# EAGLE design Adafruit I2C Quad Rotary Encoder Breakout (EAGLE 9.6.2)
COMPANY: ADAFRUIT INDUSTRIES; DRAWN: KTOWN; REV: A
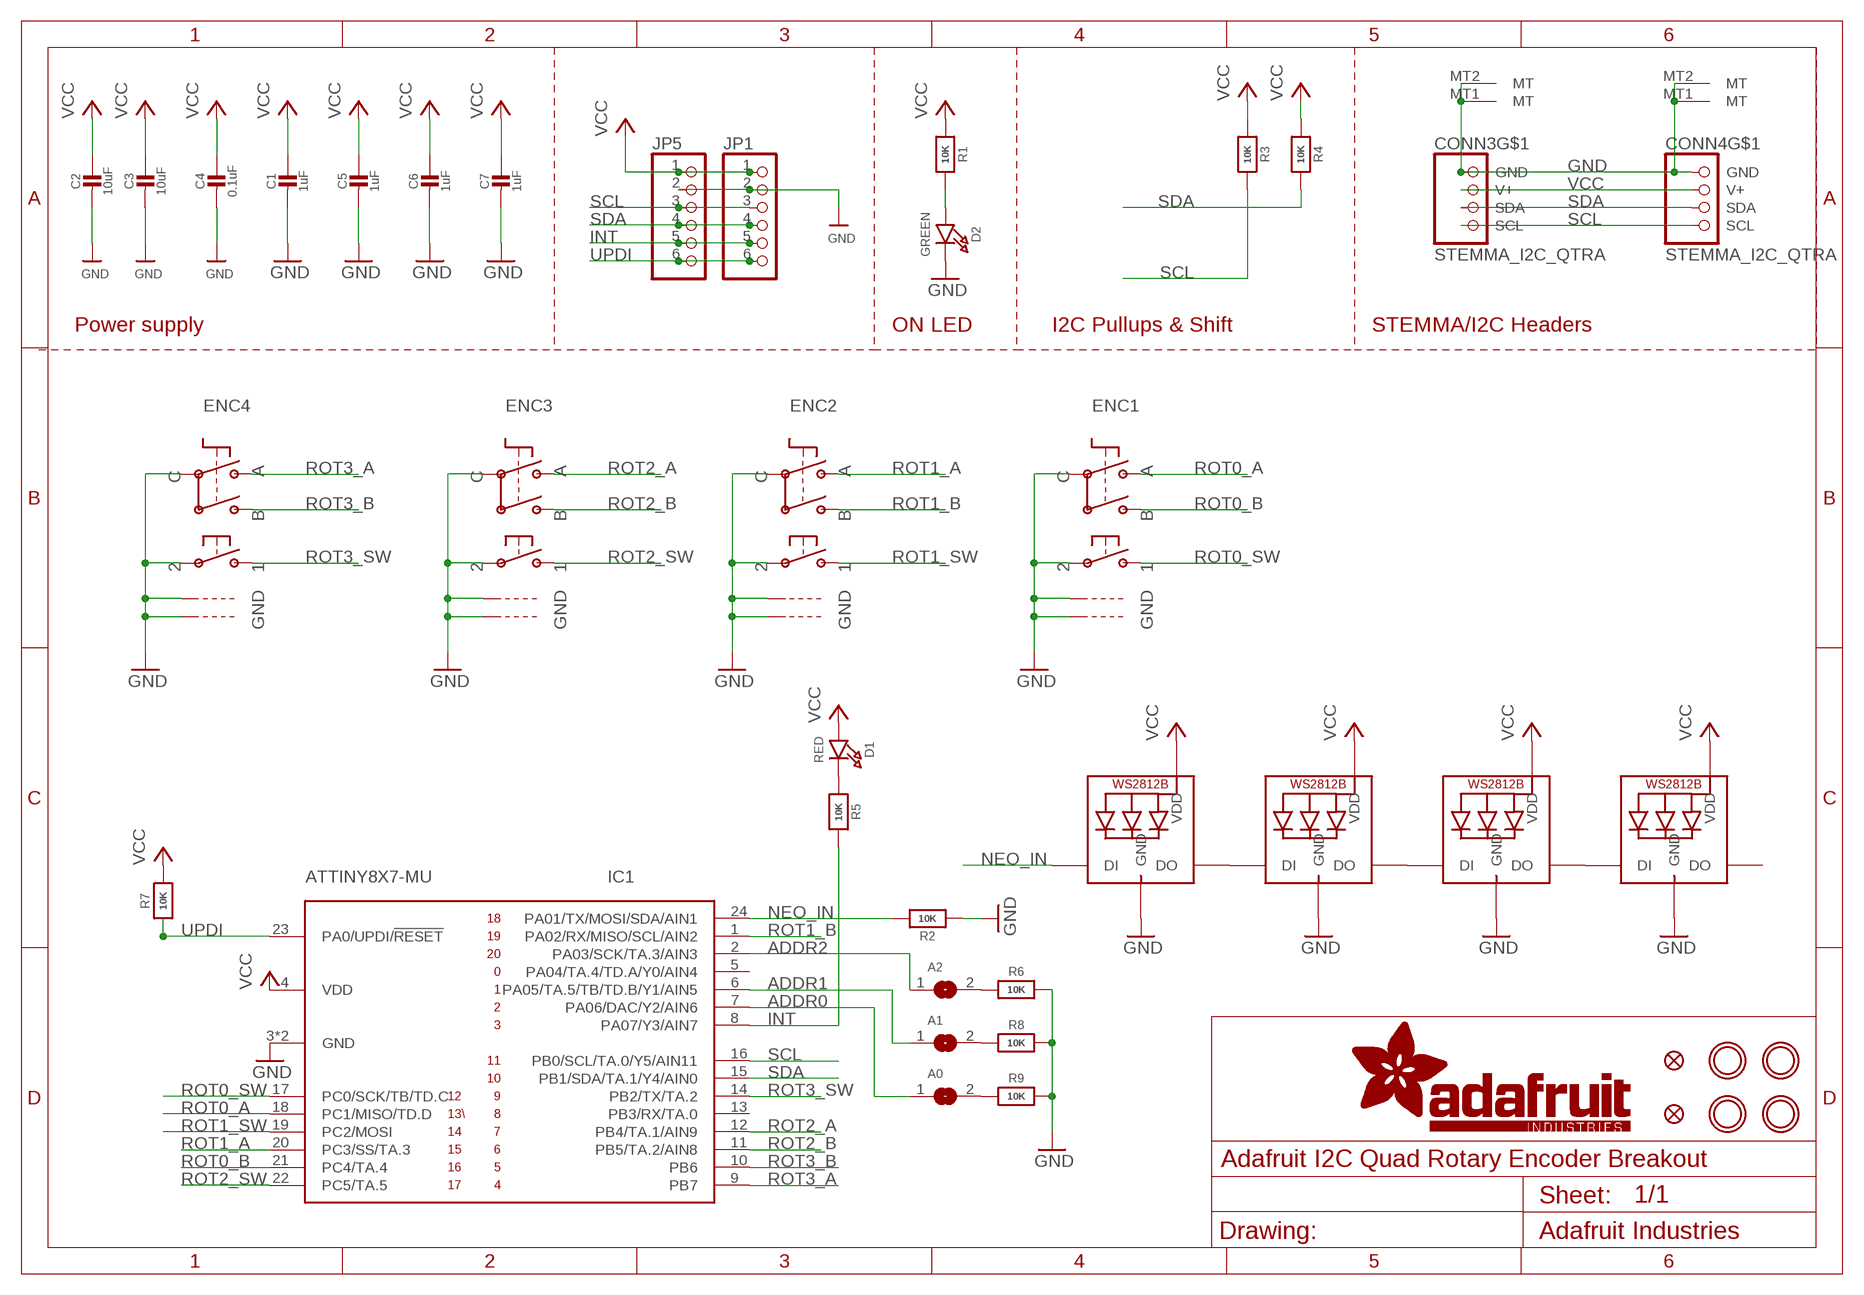
[diagram p0: schematic, sheet 1]

## Parts
A0  SOLDERJUMPERCLOSED  [SOLDERJUMPER_CLOSEDWIRE]
A1  SOLDERJUMPERCLOSED  [SOLDERJUMPER_CLOSEDWIRE]
A2  SOLDERJUMPERCLOSED  [SOLDERJUMPER_CLOSEDWIRE]
C1  1uF  CAP_CERAMIC0603_NO  [0603-NO]
C2  10uF  CAP_CERAMIC0805-NOOUTLINE  [0805-NO]
C3  10uF  CAP_CERAMIC0805-NOOUTLINE  [0805-NO]
C4  0.1uF  CAP_CERAMIC0603_NO  [0603-NO]
C5  1uF  CAP_CERAMIC0603_NO  [0603-NO]
C6  1uF  CAP_CERAMIC0603_NO  [0603-NO]
C7  1uF  CAP_CERAMIC0603_NO  [0603-NO]
CONN3  STEMMA_I2C_QTRA  [JST_SH4_RA]
CONN4  STEMMA_I2C_QTRA  [JST_SH4_RA]
D1  RED  LED0603_NOOUTLINE  [CHIPLED_0603_NOOUTLINE]
D2  GREEN  LED0603_NOOUTLINE  [CHIPLED_0603_NOOUTLINE]
ENC1  ENCODER_PLUS_SWITCH_BOURNS_PEC11  [PEC11+SWITCH]
ENC2  ENCODER_PLUS_SWITCH_BOURNS_PEC11  [PEC11+SWITCH]
ENC3  ENCODER_PLUS_SWITCH_BOURNS_PEC11  [PEC11+SWITCH]
ENC4  ENCODER_PLUS_SWITCH_BOURNS_PEC11  [PEC11+SWITCH]
FID1  FIDUCIAL_1MM  [FIDUCIAL_1MM]
FID2  FIDUCIAL_1MM  [FIDUCIAL_1MM]
IC1  ATTINY8X7-MU  [QFN24_4MM]
JP1  HEADER-1X670MIL  [1X06_ROUND_70]
JP5  HEADER-1X670MIL  [1X06_ROUND_70]
LED1  WS2812B_SK6812E  [NEO3535_REVERSE]
LED2  WS2812B_SK6812E  [NEO3535_REVERSE]
LED3  WS2812B_SK6812E  [NEO3535_REVERSE]
LED4  WS2812B_SK6812E  [NEO3535_REVERSE]
R1  10K  RESISTOR_0603_NOOUT  [0603-NO]
R2  10K  RESISTOR_0603_NOOUT  [0603-NO]
R3  10K  RESISTOR_0603_NOOUT  [0603-NO]
R4  10K  RESISTOR_0603_NOOUT  [0603-NO]
R5  10K  RESISTOR_0603_NOOUT  [0603-NO]
R6  10K  RESISTOR_0603_NOOUT  [0603-NO]
R7  10K  RESISTOR_0603_NOOUT  [0603-NO]
R8  10K  RESISTOR_0603_NOOUT  [0603-NO]
R9  10K  RESISTOR_0603_NOOUT  [0603-NO]
U$3  MOUNTINGHOLE2.5  [MOUNTINGHOLE_2.5_PLATED]
U$17  MOUNTINGHOLE2.5  [MOUNTINGHOLE_2.5_PLATED]
U$19  MOUNTINGHOLE2.5  [MOUNTINGHOLE_2.5_PLATED]
U$21  MOUNTINGHOLE2.5  [MOUNTINGHOLE_2.5_PLATED]

## Nets
ADDR0: A0.1 IC1.7(PA06/DAC/Y2/AIN6)
ADDR1: A1.1 IC1.6(PA05/TA.5/TB/TD.B/Y1/AIN5)
ADDR2: A2.1 IC1.2(PA03/SCK/TA.3/AIN3)
GND: C1.2 C2.2 C3.2 C4.2 C5.2 C6.2 C7.2 CONN3.1(GND) CONN3.MT1(MT) CONN3.MT2(MT) CONN4.1(GND) CONN4.MT1(MT) CONN4.MT2(MT) D2.C ENC1.P$2 ENC1.P$C ENC1.P$GND1 ENC1.P$GND2 ENC2.P$2 ENC2.P$C ENC2.P$GND1 ENC2.P$GND2 ENC3.P$2 ENC3.P$C ENC3.P$GND1 ENC3.P$GND2 ENC4.P$2 ENC4.P$C ENC4.P$GND1 ENC4.P$GND2 IC1.3(GND) IC1.THERM(GND) JP1.2 JP5.2 LED1.3-GND(GND) LED2.3-GND(GND) LED3.3-GND(GND) LED4.3-GND(GND) R2.1 R6.2 R8.2 R9.2
INT: IC1.8(PA07/Y3/AIN7) JP1.5 JP5.5 R5.2
N$1: D2.A R1.2
N$2: LED1.2-DOUT(DO) LED2.4-DIN(DI)
N$3: LED2.2-DOUT(DO) LED3.4-DIN(DI)
N$4: LED3.2-DOUT(DO) LED4.4-DIN(DI)
N$5: D1.C R5.1
N$6: A2.2 R6.1
N$7: A1.2 R8.1
N$8: A0.2 R9.1
NEO_IN: IC1.24(PA01/TX/MOSI/SDA/AIN1) LED1.4-DIN(DI) R2.2
ROT0_A: ENC1.P$A IC1.18(PC1/MISO/TD.D)
ROT0_B: ENC1.P$B IC1.21(PC4/TA.4)
ROT0_SW: ENC1.P$1 IC1.17(PC0/SCK/TB/TD.C)
ROT1_A: ENC2.P$A IC1.20(PC3/SS/TA.3)
ROT1_B: ENC2.P$B IC1.1(PA02/RX/MISO/SCL/AIN2)
ROT1_SW: ENC2.P$1 IC1.19(PC2/MOSI)
ROT2_A: ENC3.P$A IC1.12(PB4/TA.1/AIN9)
ROT2_B: ENC3.P$B IC1.11(PB5/TA.2/AIN8)
ROT2_SW: ENC3.P$1 IC1.22(PC5/TA.5)
ROT3_A: ENC4.P$A IC1.9(PB7)
ROT3_B: ENC4.P$B IC1.10(PB6)
ROT3_SW: ENC4.P$1 IC1.14(PB2/TX/TA.2)
SCL: CONN3.4(SCL) CONN4.4(SCL) IC1.16(PB0/SCL/TA.0/Y5/AIN11) JP1.3 JP5.3 R3.2
SDA: CONN3.3(SDA) CONN4.3(SDA) IC1.15(PB1/SDA/TA.1/Y4/AIN0) JP1.4 JP5.4 R4.2
UPDI: IC1.23(PA0/UPDI/!RESET) JP1.6 JP5.6 R7.1
VCC [power]: C1.1 C2.1 C3.1 C4.1 C5.1 C6.1 C7.1 CONN3.2(V+) CONN4.2(V+) D1.A IC1.4(VDD) JP1.1 JP5.1 LED1.1-VDD(VDD) LED2.1-VDD(VDD) LED3.1-VDD(VDD) LED4.1-VDD(VDD) R1.1 R3.1 R4.1 R7.2
Unconnected: IC1.5(PA04/TA.4/TD.A/Y0/AIN4) IC1.13(PB3/RX/TA.0) LED4.2-DOUT(DO)

## Notes on the sheet
- Power supply | ON LED | I2C Pullups & Shift | STEMMA/I2C Headers

## Library data of the parts
A0 A1 A2 = microbuilder:SOLDERJUMPER: SMD Solder JUMPER Solder the two pads together to create a connection, or remove the solder to break it. REFLOW - Use this footprint for solder paste and reflow ovens. WAVE - Use this footprint for hand-soldering (larger pads). CLOSED - Has a trace between the two pads to ensure it is closed by default. The trace needs to be cut to disable the jumper, and can be closed again by creating a solder bridge between the two pads.
C1-C7 = microbuilder:CAP_CERAMIC: Ceramic Capacitors For new designs, use the packages preceded by an '_' character since they are more reliable: The following footprints should be used on most boards: _0402 - Standard footprint for regular board layouts _0603 - Standard footprint for regular board layouts _0805 - Standard footprint for regular board layouts _1206 - Standard footprint for regular board layouts For extremely tight-pitch boards where space is at a premium, the following 'micro-pitch' footprints can be used (smaller pads, no silkscreen outline, etc.): _0402MP - Micro-pitch footprint for very dense/compact boards _0603MP - Micro-pitch footprint for very dense/compact boards _0805MP - Micro-pitch footprint for very dense/compact boards _1206MP - Micro-pitch footprint for very dense/compact boards
CONN3 CONN4 = adafruit_electromech:STEMMA_I2C; LCSC: C145961
D1 D2 = microbuilder:LED: LED 0603 - 0603 Surface Mount Package 2mA: Green LED - Low Power (3.9mcd, 2ma, 1.7Vf) - Digikey: 475-2709-2-ND Orange LED - Low Power (9.8mcd, 2ma, 1.8Vf) - Digikey: 475-1194-2-ND Red LED - Low Power (5mcd, 2ma, 1.8Vf) - Digikey: 475-1195-2-ND Yellow LED - Low Power (7mcd, 2ma, 1.8Vf) - Digikey: 475-1196-2-ND 5mA: Blue LED - Low Power (17mcd, 5ma, 2.9Vf) - Digikey: LNJ937W8CRACT-ND 0805 - 0805 Surface Mount Package 2mA: Red LED (8.8mcd, 2mA, 1.8Vf, Clear) - Low Power [Digikey: 475-2510-1-ND] Green LED (5mcd, 2mA, 1.8Vf, Clear) - Low Power [Digikey: 475-2730-1-ND] Yellow LED (11.3mcd, 2mA, 1.8Vf, Clear) - Low Power [Digikey: 475-2555-1-ND] 20mA: Red LED (104mcd, 20mA, Diffused) - LS R976 [Digikey: 475-1278-6-ND] Red LED (12mcd, 20mA, 2.0Vf, Clear) - APT2012EC [Digikey: 754-1128-1-ND] Green LED (15mcd, 20mA, 2.2Vf, Clear) - APT2012GC [Digikey: 754-1131-1-ND] Orange LED (160mcd, 20mA, 2.1Vf, Clear) - APT2012SECK [Digikey: 754-1130-1-ND] 1206 - 1206 Surface Mount Package Green LED (26mcd, 20mA, Diffused) - LG N971 [Digikey: 475-1407-6-ND] Red LED (15mcd, 20mA, Diffused) - LH N974 [Digikey: 475-1416-6-ND] Cree - Cree High-Power Surface Mount LEDs XPEBWT-L1-0000-00D50 - White 111lm 350mA 2.9Vf 6200K 110° XTEAWT-00-0000-00000LEE3 - White 114lm 350mA 2.85Vf 5000K 115° Everlight - Everlight 45-21 Series Surface Mount LEDs 45-21/QK2C-B2832AC2CB2/2T - Warm White 2000mcd 20mA 3.25Vf 3050K 120° 45-21/LK2C-B38452C4CB2/2T - Nuetral White 2000mcd 20mA 3.25Vf 4150K 120° 45-21/LK2C-B50634C6CB2/2T - Cold White 2200mcd 20mA 3.25Vf 5650K 120° PLCC2 Reverse Mount LS T77K-J1L2-1-0-2-R18-Z - Red 11.25mcd 2mA 1.8Vf 630nm 120° LO T77K-L1M2-24-Z - Orange 19.6mcd 2mA 1.8Vf 606nm 120° LY T77K-K2M1-26-Z - Yellow 15.7mcd 2mA 1.8Vf 587nm 120°; ROT: 270
ENC1-ENC4 = adafruit_electromech:ENCODER_PLUS_SWITCH: Rotary Encoder with Built-In Switch PEC11 - 24 Step, PEC11-4215F-S24 - http://www.adafruit.com/products/377
FID1 FID2 = microbuilder:FIDUCIAL: Fiducial Alignment Points Various fiducial points for machine vision alignment.; BOM: EXCLUDE
IC1 = adafruit_micro:ATTINY8X7
JP1 JP5 = microbuilder:HEADER-1X6: PIN HEADER
LED1-LED4 = microbuilder:WS2812B
R1-R9 = microbuilder:RESISTOR: Resistors For new designs, use the packages preceded by an '_' character since they are more reliable: The following footprints should be used on most boards: _0402 - Standard footprint for regular board layouts _0603 - Standard footprint for regular board layouts _0805 - Standard footprint for regular board layouts _1206 - Standard footprint for regular board layouts For extremely tight-pitch boards where space is at a premium, the following 'micro-pitch' footprints can be used (smaller pads, no silkscreen outline, etc.): _0402MP - Micro-pitch footprint for very dense/compact boards _0603MP - Micro-pitch footprint for very dense/compact boards _0805MP - Micro-pitch footprint for very dense/compact boards _1206MP - Micro-pitch footprint for very dense/compact boards
U$3 U$17 U$19 U$21 = adafruit_electromech:MOUNTINGHOLE: Mounting Hole For #2 screws (0.086"/2.18mm width, 0.094"/2.4mm hole) use 2.5mm; BOM: EXCLUDE

## Net classes
1 power: width 0.305 mm, drill 0.483 mm
2 lowpower: width 0.254 mm, drill 0.483 mm

## Board
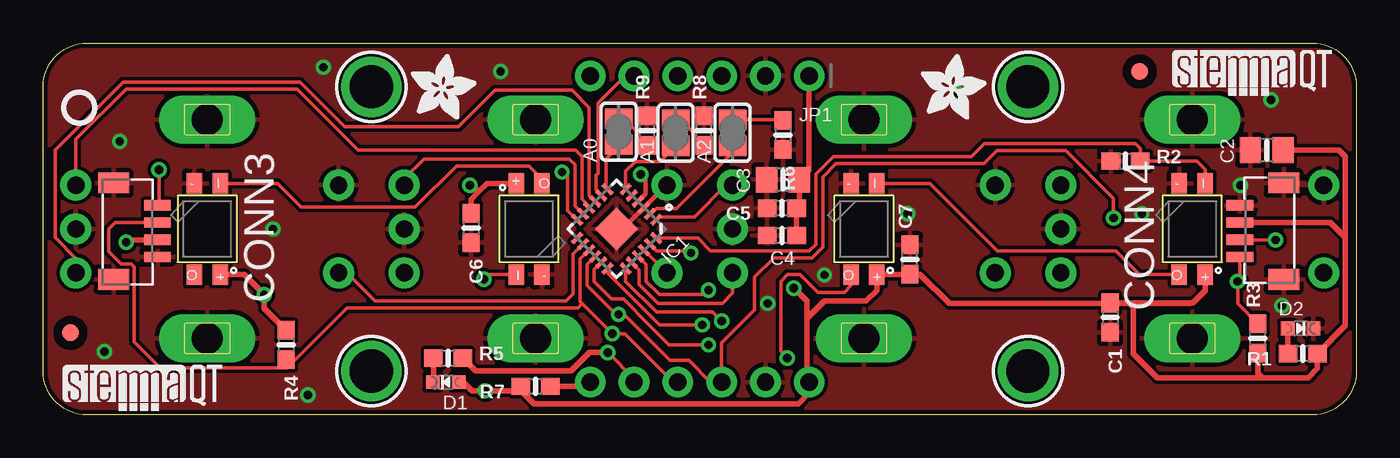
[diagram p1: board, top side]
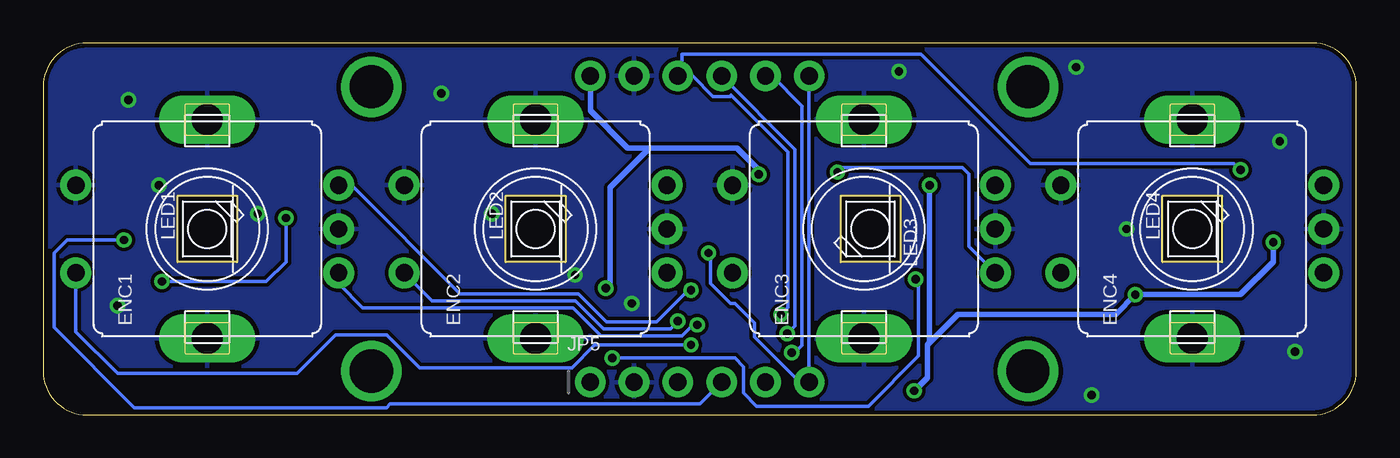
[diagram p2: board, bottom side, seen from below]

Size 76.2 x 21.59 mm. Coordinates in mm from the lower left corner, seen from the top.
Outline: 76.2,19.05 76.2,2.54 arc-90 73.66,0 2.54,0 arc-90 0,2.54 0,19.05 arc-90 2.54,21.59 73.66,21.59 arc-90 76.2,19.05
Copper layers (1*16): Top 0.035mm / dielectric 1.5mm / Bottom 0.035mm
Design rules "adafruit *": minimum track width 8mil, minimum drill 15.5mil, track to track 8mil, track to pad 8mil, pad to pad 8mil, via to via 8mil, smd to smd 8mil, copper to edge 10mil, drill to drill 8mil, minimum pad ring 10mil, minimum via ring 8mil, stop-mask expansion 2mil, vias tented up to drill 20mil, thermal gap 10mil

### Footprints (pad centres in the part's own frame; a part is rotated, then mirrored left to right if it is on the bottom)
SOLDERJUMPER_CLOSEDWIRE = smd 1.168 x 1.6: 1 -0.762,0; 2 0.762,0 | smd 0.635 x 0.203: WIRE 0,0
0603-NO = smd 1.075 x 1: 1 -0.85,0; 2 0.85,0
0805-NO = smd 1.24 x 1.5: 1 -0.95,0; 2 0.95,0
JST_SH4_RA = smd 0.6 x 1.55: 1 1.5,0.924; 2 0.5,0.924; 3 -0.5,0.924; 4 -1.5,0.924 | smd 1.2 x 1.8: MT1 -2.8,-1.624; MT2 2.8,-1.624
CHIPLED_0603_NOOUTLINE = smd 0.8 x 0.8: A 0,-0.75; C 0,0.75
PEC11+SWITCH = drill 1 pad 1.8: P$1 -2.54,7.62; P$2 2.54,7.62; P$A -2.54,-7.62; P$B 2.54,-7.62; P$C 0,-7.62 | drill 1.8 pad 2.8 long: P$GND1 -6.35,0; P$GND2 6.35,0
FIDUCIAL_1MM = smd 1 x 1: 1 0,0
QFN24_4MM = smd 0.8 x 0.28: 1 -2,1.25; 2 -2,0.75; 3 -2,0.25; 4 -2,-0.25; 5 -2,-0.75; 6 -2,-1.25; 13 2,-1.25; 14 2,-0.75; 15 2,-0.25; 16 2,0.25; 17 2,0.75; 18 2,1.25 | smd 0.28 x 0.8: 7 -1.25,-2; 8 -0.75,-2; 9 -0.25,-2; 10 0.25,-2; 11 0.75,-2; 12 1.25,-2; 19 1.25,2; 20 0.75,2; 21 0.25,2; 22 -0.25,2; 23 -0.75,2; 24 -1.25,2 | smd 1.778 x 1.778: THERM 0,0
1X06_ROUND_70 = drill 1 pad 1.778: 1 -6.35,0; 2 -3.81,0; 3 -1.27,0; 4 1.27,0; 5 3.81,0; 6 6.35,0
NEO3535_REVERSE = smd 1.2 x 0.9 bottom: 1-VDD 2.65,-0.75; 2-DOUT 2.65,0.75; 3-GND -2.65,0.75; 4-DIN -2.65,-0.75
MOUNTINGHOLE_2.5_PLATED = drill 2.5 pad 3.2: P$1 0,0

### Placement (x,y rotation side)
A0  33.4,16.45 90 top
A1  36.7,16.38 90 top
A2  40.01,16.38 90 top
C1  61.91,5.65 270 top
C2  70.99,15.37 180 top
C3  42.93,13.65 180 top
C4  42.86,10.41 180 top
C5  42.86,12 180 top
C6  24.83,10.86 270 top
C7  50.29,9.02 90 top
CONN3  5.72,10.67 270 top
CONN4  70.36,10.67 90 top
D1  23.37,1.9 90 top
D2  72.96,5.02 270 top
ENC1  66.67,10.79 90 bottom
ENC2  47.62,10.79 90 bottom
ENC3  28.58,10.79 90 bottom
ENC4  9.53,10.79 90 bottom
FID1  63.63,19.94 0 top
FID2  1.59,4.76 0 top
IC1  33.27,10.79 225 top
JP1  38.1,19.69 180 top
JP5  38.1,1.9 0 bottom
LED1  66.67,10.79 270 bottom
LED2  47.62,10.79 270 bottom
LED3  28.19,10.79 90 bottom
LED4  9.53,10.79 270 bottom
PLABEL0  [PLABEL0]  44.2,4.19 90 top
PLABEL1  [PLABEL1]  41.97,3.43 0 top
PLABEL2  [PLABEL2]  39.37,3.56 90 top
PLABEL3  [PLABEL3]  36.7,3.56 90 top
PLABEL4  [PLABEL4]  34.42,3.49 0 top
PLABEL5  [PLABEL5]  72.14,1.78 0 top
PLABEL6  [PLABEL6]  8.7,20.19 0 top
PLABEL7  [PLABEL7]  8.7,15.11 0 top
PLABEL8  [PLABEL8]  42.04,18.35 0 top
PLABEL9  [PLABEL9]  46.99,19.69 0 top
PLABEL10  [PLABEL10]  38.23,18.61 90 top
PLABEL11  [PLABEL11]  35.69,18.67 90 top
PLABEL12  [PLABEL12]  33.27,18.67 90 top
PLABEL13  [PLABEL13]  41.72,16.51 90 top
PLABEL14  [PLABEL14]  37.78,13.84 90 top
PLABEL15  [PLABEL15]  31.62,15.43 90 top
PLABEL16  [PLABEL16]  23.62,0.83 0 top
PLABEL17  [PLABEL17]  43.81,18.03 0 bottom
PLABEL18  [PLABEL18]  41.85,18.16 0 bottom
PLABEL19  [PLABEL19]  39.24,18.03 0 bottom
PLABEL20  [PLABEL20]  36.58,18.16 0 bottom
PLABEL21  [PLABEL21]  33.91,18.1 0 bottom
PLABEL22  [PLABEL22]  43.69,3.43 0 bottom
PLABEL23  [PLABEL23]  41.72,3.43 0 bottom
PLABEL24  [PLABEL24]  39.37,3.56 90 bottom
PLABEL25  [PLABEL25]  36.96,3.56 90 bottom
PLABEL26  [PLABEL26]  34.16,3.49 0 bottom
PLABEL27  [PLABEL27]  66.55,1.65 0 bottom
PLABEL28  [PLABEL28]  47.62,1.65 0 bottom
PLABEL29  [PLABEL29]  28.45,1.78 0 bottom
PLABEL30  [PLABEL30]  9.4,1.65 0 bottom
PLABEL31  [PLABEL31]  66.42,20.07 0 bottom
PLABEL32  [PLABEL32]  9.02,19.81 0 bottom
R1  73.09,3.56 180 top
R2  62.8,14.73 0 top
R3  70.48,4.45 90 top
R4  14.1,4.06 270 top
R5  23.5,3.3 0 top
R6  42.93,16.26 270 top
R7  28.58,1.65 180 top
R8  38.35,16.51 90 top
R9  35.05,16.51 90 top
U$2  [ADAFRUIT_3.5MM]  21.34,17.14 0 top
U$3  57.15,19.05 0 top
U$9  [ADAFRUIT_3.5MM]  50.93,17.14 0 top
U$17  19.05,19.05 0 top
U$19  57.15,2.54 0 top
U$21  19.05,2.54 0 top
U$25  [PCBFEAT-REV-040]  2.1,17.84 0 top
U$30  [STEMMAQT]  1.14,0.25 0 top
U$31  [STEMMAQT]  65.53,18.54 0 top

### Tracks (layer width: path | path; a pad name or v marks a point on that pad's centre or on a via)
ADDR0
  Top 0.203: A0.1 33.4,15.6 32.66,14.86 32.66,13.17 IC1.7
ADDR1
  Top 0.203: IC1.6 33.8,14.16 34.36,14.72 35.8,14.72 A1.1
ADDR2
  Top 0.203: A2.1 40.01,15.24 36.75,11.98 35.6,11.98 35.3,11.68 IC1.2
GND  (via drill 0.48)
  Top 0.254: 36.17,13.34 IC1.3 33.63,10.79
  Top 0.305: 36.17,13.34 ENC3.P$2 | 33.63,10.79 IC1.THERM
  other vias: 69.47,13.34 71.88,6.35 63.75,11.68 50.16,11.68 45.34,8.13 42.04,6.48 26.54,19.94 13.34,10.79 4.45,15.88 3.56,3.68 15.37,1.14 16.26,20.19 53.09,18.67 71.25,18.29
  pour Bottom: 76.2,21.59 0,21.59 0,0 76.2,0
  pour Top: 76.2,21.59 0,21.59 0,0 76.2,0
INT  (via drill 0.48)
  Top 0.203: JP1.5 33.78,19.69 32.19,18.09 32.19,14.03 32.09,13.93 32.09,13.04 IC1.8 | v32.77,3.62 34.29,2.09 JP5.5
  Top 0.305: v32.77,3.62 31.7,3.62 30.64,2.55 25.09,2.55 R5.2
  Bottom 0.203: JP1.5 33.91,19.69 32.16,17.93 32.16,4.04 32.58,3.62 v32.77,3.62
N$1
  Top 0.305: R1.2 72.21,3.58 D2.A
N$2
  Top 0.203: LED2.4-DIN 51.45,13.45 55.37,9.53 62.23,9.53 63.61,8.14 LED1.2-DOUT
N$3  (via drill 0.48)
  Top 0.203: LED3.4-DIN 25.84,8.14 v25.57,7.87 | v43.18,3.3 42.8,3.68 42.8,7.75 43.2,8.14 43.93,8.14 44.96,7.11 46.48,7.11 46.88,7.5 LED2.2-DOUT
  Bottom 0.203: v25.57,7.87 25.4,7.71 25.4,3.43 28.32,0.51 34.8,0.51 35.56,1.27 35.56,2.79 36.07,3.3 v43.18,3.3
N$4
  Top 0.203: LED3.2-DOUT 28.94,13.7 28.19,14.45 23.98,14.45 21.59,12.06 14.99,12.06 13.61,13.45 LED4.4-DIN
N$5
  Top 0.305: R5.1 22.65,1.93 D1.C
N$6
  Top 0.203: A2.2 42.89,17.14 R6.1
N$7
  Top 0.203: R8.1 37.81,16.21 37.81,16.33 36.99,17.14 A1.2
N$8
  Top 0.203: R9.1 34.51,16.21 34.51,16.39 33.69,17.21 A0.2
NEO_IN
  Top 0.203: LED1.4-DIN 67.42,14.24 66.93,14.73 R2.2 63.65,15.47 63.37,15.75 54.61,15.75 53.85,14.99 45.85,14.99 44.83,13.97 44.83,9.91 44.45,9.53 38.73,9.53 38,10.27 IC1.24
ROT0_A  (via drill 0.48)
  Top 0.203: v38.25,5.23 35.76,5.23 32.74,8.24 IC1.18
  Bottom 0.203: v38.25,5.23 38.5,5.23 39.13,4.6 43.84,4.6 45.47,6.22 57.66,6.22 59.05,7.62 ENC1.P$A
ROT0_B  (via drill 0.48)
  Top 0.203: IC1.21 34.99,8.72 34.99,7.76 35.76,6.98 38.35,6.98 v38.61,7.24
  Bottom 0.203: v38.61,7.24 38.79,7.24 40.62,5.41 43.5,5.41 45.13,7.04 51.99,7.04 58.29,13.34 ENC1.P$B
ROT0_SW  (via drill 0.48)
  Top 0.203: v38.61,4.06 36.32,4.06 35.17,5.22 35.17,5.24 33.68,6.73 33,6.73 31.98,7.75 31.98,8.44 IC1.17
  Bottom 0.203: v38.61,4.06 44.2,4.06 45.52,2.74 54.36,2.74 56.27,4.66 59.22,4.66 61.47,2.41 71.88,2.41 74.3,4.83 ENC1.P$1
ROT1_A
  Top 0.203: IC1.20 34.58,8.43 34.58,7.59 35.05,7.12 35.05,7.11 35.69,6.48 39.41,6.48 40.01,7.07 ENC2.P$A
ROT1_B
  Top 0.203: ENC2.P$B 39.62,13.34 37.78,11.49 35.74,11.49 IC1.1
ROT1_SW  (via drill 0.48)
  Top 0.203: v39.37,5.44 38.83,5.98 35.58,5.98 33.8,7.76 IC1.19
  Bottom 0.203: v39.37,5.44 39.8,5 43.67,5 45.3,6.63 53.62,6.63 ENC2.P$1
ROT2_A  (via drill 0.48)
  Top 0.203: v30.11,14.09 30.16,14.09 30.44,13.81 30.44,11.86 IC1.12
  Bottom 0.203: ENC3.P$A 22.48,9.78 22.48,13.97 22.86,14.35 29.86,14.35 v30.11,14.09
ROT2_B
  Top 0.203: ENC3.P$B 20.96,13.72 22.1,14.86 30.53,14.86 30.87,14.52 30.87,12.14 IC1.11
ROT2_SW
  Top 0.203: IC1.22 34.89,9.56 ENC3.P$1
ROT3_A
  Top 0.203: ENC4.P$A 1.91,9.09 0.7,10.3 0.7,15.37 4.66,19.33 14.9,19.33 17.5,16.73 24.1,16.73 26.22,18.85 30.68,18.85 31.68,17.85 31.68,16.64 31.68,16.44 31.68,14.09 31.68,12.74 IC1.9
ROT3_B
  Top 0.203: ENC4.P$B 1.91,16 4.83,18.92 14.73,18.92 18.29,15.37 30.89,15.37 31.27,14.99 31.27,14.26 | 31.27,14.26 | IC1.10 31.68,12.11 31.27,12.52 31.27,14.26
ROT3_SW
  Top 0.203: ENC4.P$1 17.65,8.25 19.28,6.63 30.35,6.63 30.76,7.04 30.76,9.34 IC1.14
SCL  (via drill 0.48)
  Top 0.203: v6.73,14.22 6.73,12.26 CONN3.4 | 33.2,5.88 33.69,5.88 36.39,3.17 37.47,3.17 38.73,1.9 JP5.3 39.37,4.19 41.27,6.1 41.27,8 42.39,9.12 44.62,9.12 45.24,9.74 45.24,13.8 46.02,14.58 54.59,14.58 55.35,15.34 59.33,15.34 62.1,12.57 v62.1,11.43 | 33.2,5.88 31.57,7.51 31.57,8.74 IC1.16 | v33.39,5.83 33.25,5.83 33.2,5.88 | R3.2 69.31,6.47 v69.31,7.75 69.43,7.87 CONN4.4
  Bottom 0.203: 39.12,19.69 38.52,19.69 37.32,18.49 36.34,18.49 36.27,18.55 32.97,15.25 32.97,6.25 v33.39,5.83 | 39.12,19.69 JP1.3 | v6.73,14.22 7.11,14.61 18.92,14.61 25.27,20.95 39.12,20.95 39.12,19.69 | v62.1,11.43 62.1,8.89 63.25,7.75 v69.31,7.75
SDA  (via drill 0.48)
  Top 0.203: JP5.4 36.58,1.9 33.77,4.71 v33.03,4.71 31.27,6.47 | IC1.15 31.17,9.04 31.17,6.58 31.27,6.47 | CONN3.3 4.18,11.17 3.81,10.79 3.81,9.48 4.52,8.77 5.12,8.77 5.3,8.59 5.3,4.23 6.79,2.74 14.1,2.74 | 14.1,2.74 14.17,2.74 17.65,6.22 31.03,6.22 31.27,6.47 | R4.2 14.1,2.74 | v71.5,10.16 69.44,10.16 CONN4.3
  Bottom 0.203: JP1.4 32.56,15.42 32.56,5.18 v33.03,4.71 | JP5.4 38.1,0.63 56.06,0.63 56.27,0.42 70.91,0.42 75.56,5.08 75.56,9.4 74.8,10.16 v71.5,10.16
UPDI  (via drill 0.48)
  Top 0.203: IC1.23 35.61,9.53 37.47,9.53 v37.59,9.4
  Top 0.305: R7.1 31.5,1.65 JP5.6
  Bottom 0.203: JP1.6 JP5.6 32.3,1.9 34.93,4.54 34.93,5.33 36.07,6.48 36.32,6.48 37.47,7.62 37.47,9.27 v37.59,9.4
VCC  (via drill 0.48)
  Top 0.254: IC1.4 34.94,12.81 34.94,13.97
  Top 0.305: LED3.1-VDD 25.76,13.45 25.27,12.95 | C6.1 24.83,12.51 25.27,12.95 | v24.77,13.34 24.89,13.34 25.27,12.95 | LED4.1-VDD 11.67,8.14 v12.83,6.98 12.83,6.18 R4.1 | v4.83,10.03 4.96,10.17 CONN3.2 | C1.1 62.99,6.5 | CONN4.2 74.68,11.17 75.56,10.29 | 75.56,10.29 75.56,5.18 R1.1 73.94,2.69 73.41,2.16 70.74,2.16 | C2.1 75.18,15.37 75.56,14.99 75.56,10.29 | 34.94,13.97 v34.67,13.97 | JP1.1 44.45,14.23 C3.1 43.88,12 C5.1 C4.1 | 44.32,5.59 44.32,2.03 JP5.1 44.45,1.27 43.81,0.63 28.49,0.63 27.73,1.4 R7.2 27.73,1.44 27.69,1.4 v25.65,1.4 24.89,1.4 24.38,1.9 D1.A | 44.32,5.59 45.34,6.6 47.75,6.6 48.38,7.23 LED2.1-VDD 50.27,8.14 C7.1 50.89,8.17 52.58,6.48 66.52,6.48 66.55,6.5 | v43.56,7.37 44.32,6.6 44.32,5.59 | R3.1 70.48,2.41 70.74,2.16 | 62.99,6.5 63.25,6.25 63.25,3.56 64.64,2.16 70.74,2.16 | LED1.1-VDD 67.42,7.23 66.7,6.5 66.55,6.5 | 62.99,6.5 66.55,6.5
  Bottom 0.305: v25.65,1.4 24.89,2.16 24.89,4.06 24.77,4.19 | 24.77,4.19 v24.77,13.34 | 24.77,4.19 23.11,5.84 13.97,5.84 v12.83,6.98 6.73,6.98 4.83,8.89 v4.83,10.03 | v34.67,13.97 34.67,14.22 35.94,15.49 41.02,15.49 | 41.02,15.49 42.29,15.49 44.45,17.65 JP1.1 | 41.02,15.49 43.31,13.21 43.31,7.62 v43.56,7.37

### Text on the board
Pinguin_tBackup: NeoRotary 4 | VIN | I | D | C | - | A2 | VLogic/Vcc: 3-5VDC | A0 | A1 | INT | D | C | - | VIN | on | INT
Pinguin_bBackup: adafruit! | VIN | NeoRotary 4 | INT | D | C | - | INT | D | C | - | VIN | #3 | #2 | #1 | #0